# EAGLE design EPGinput (EAGLE 7.7.0)
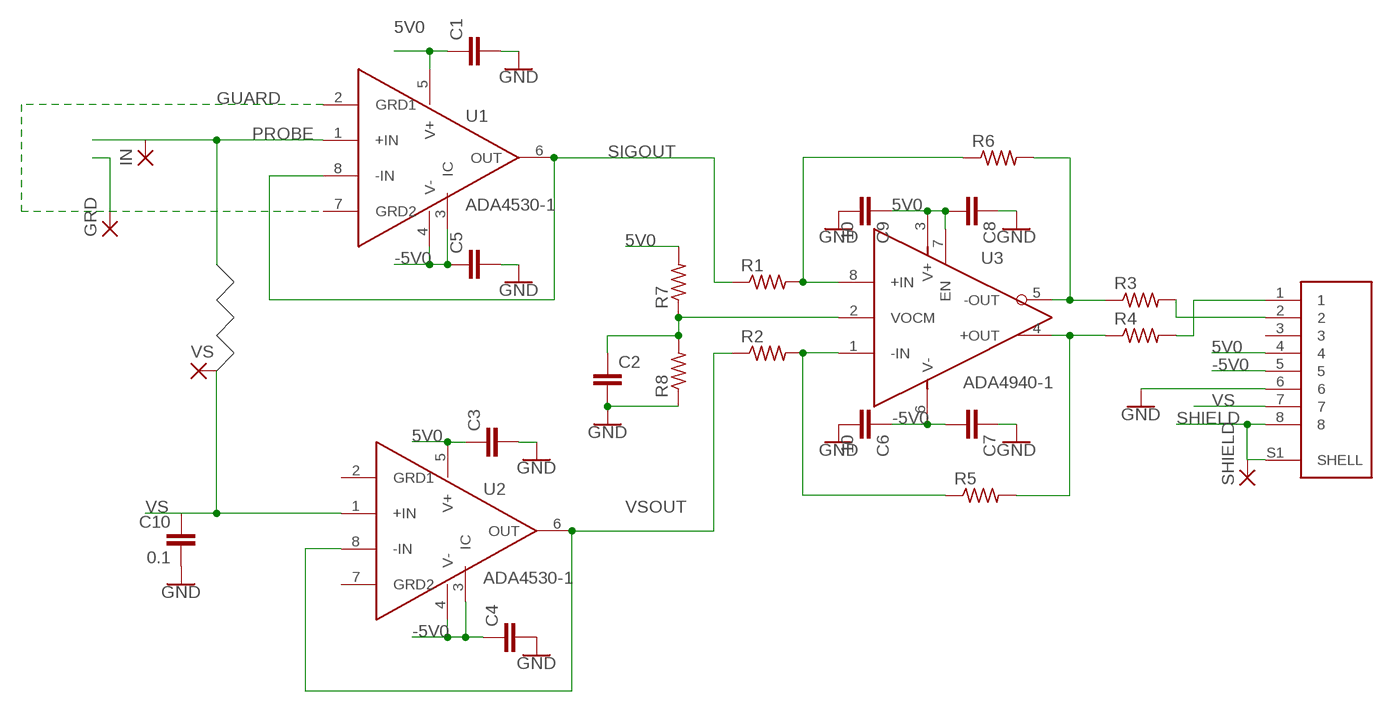
[diagram p0: schematic, sheet 1]

## Parts
C1  CAPS0603S  [0603S]
C2  CAPS0603S  [0603S]
C3  CAPS0603S  [0603S]
C4  CAPS0603S  [0603S]
C5  CAPS0603S  [0603S]
C6  10  CAPS1206S  [1206S]
C7  CAPS0603S  [0603S]
C8  CAPS0603S  [0603S]
C9  10  CAPS1206S  [1206S]
C10  0.1  CAPS0603S  [0603S]
GRD  2,15/1,0  [2,15/1,0]
IN  SMD2  [SMD1,27-2,54]
J1  54-00248  [TENSILITY_54-00248]
R1  RESISTOR_SM0805S  [0805S]
R2  RESISTOR_SM0805S  [0805S]
R3  RESISTOR_SM0805S  [0805S]
R4  RESISTOR_SM0805S  [0805S]
R5  RESISTOR_SM0805S  [0805S]
R6  RESISTOR_SM0805S  [0805S]
R7  RESISTOR_SM0805S  [0805S]
R8  RESISTOR_SM0805S  [0805S]
SHIELD  2,15/1,0  [2,15/1,0]
U1  ADA4530-1  [SOIC-8]
U2  ADA4530-1  [SOIC-8]
U3  ADA4940-1  [SOIC-8]
VS  2,15/1,0  [2,15/1,0]

## Nets
5V0: C1.1 C3.1 C8.2 C9.1 J1.4 R7.2 U1.5(V+) U2.5(V+) U3.3(V+) U3.7(EN)
-5V0: C4.1 C5.1 C6.1 C7.2 J1.5 U1.3(IC) U1.4(V-) U2.3(IC) U2.4(V-) U3.6(V-)
GND: C1.2 C2.2 C3.2 C4.2 C5.2 C6.2 C7.1 C8.1 C9.2 C10.2 J1.6 R8.1
GUARD: GRD.1(P) U1.2(GRD1) U1.7(GRD2)
N$1: C2.1 R7.1 R8.2 U3.2(VOCM)
N$6: R1.2 R6.1 U3.8(+IN)
N$7: R2.2 R5.1 U3.1(-IN)
N$9: J1.2 R3.2
N$10: J1.1 R4.2
N$19: R4.1 R5.2 U3.4(+OUT)
N$20: R3.1 R6.2 U3.5(-OUT)
PROBE: IN.1(P) U1.1(+IN)
SHIELD: J1.8 J1.S1(SHELL) SHIELD.1(P)
SIGOUT: R1.1 U1.6(OUT) U1.8(-IN)
VS: C10.1 J1.7 U2.1(+IN) VS.1(P)
VSOUT: R2.1 U2.6(OUT) U2.8(-IN)
Unconnected: J1.3 U2.2(GRD1) U2.7(GRD2)

## Library data of the parts
C1-C10 = STEVES_BU:CAPS
GRD SHIELD VS = wirepad:2,15/1,0: THROUGH-HOLE PAD
IN = wirepad:SMD2: SMD PAD
J1 = 54-00248:54-00248
R1-R8 = STEVES_BU:RESISTOR_SM
U1 U2 = EPG:ADA4530-1
U3 = EPG:ADA4940-1

## Board
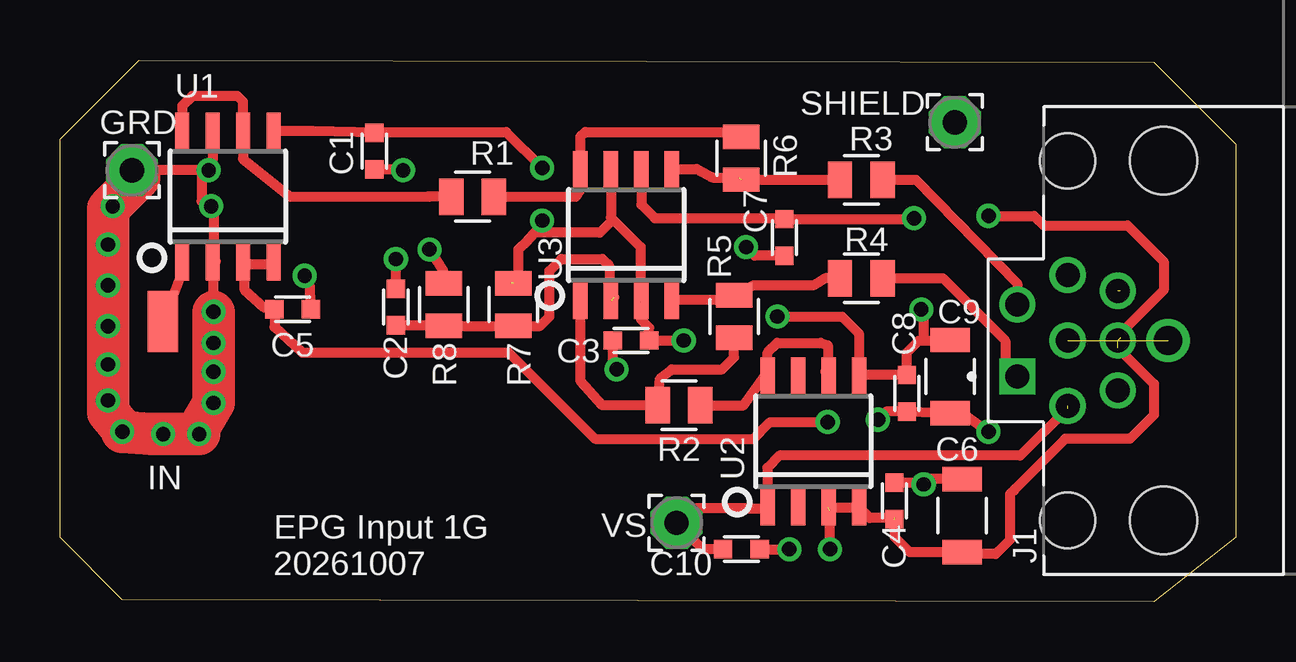
[diagram p1: board, top side]
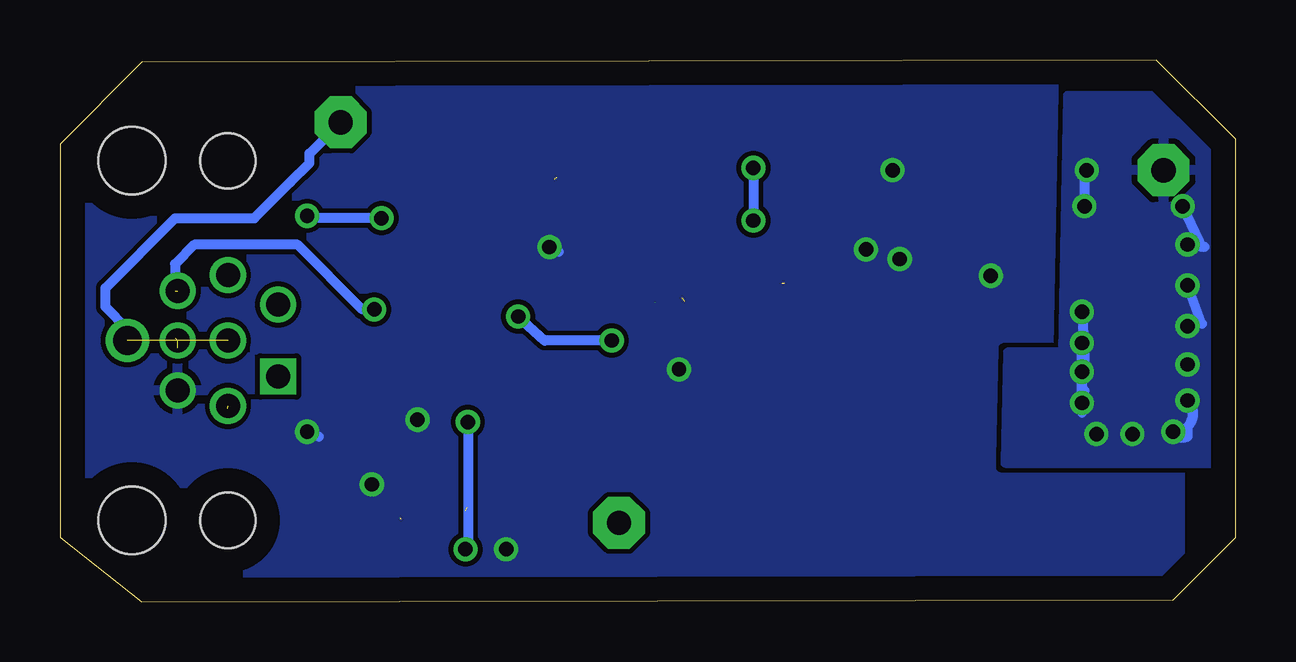
[diagram p2: board, bottom side, seen from below]

Size 49 x 22.6 mm. Coordinates in mm from the lower left corner, seen from the top.
Outline: 45.6,22.5 49,19.1 49,2.7 45.6,0 2.6,0.1 0,2.7 0,19.3 3.3,22.6 45.6,22.5
Copper layers (1*16): Top 0.035mm / dielectric 1.5mm / Bottom 0.035mm
Design rules "default *": minimum track width 10mil, minimum drill 15mil, track to track 8mil, track to pad 8mil, pad to pad 8mil, via to via 8mil, smd to smd 8mil, copper to edge 40mil, drill to drill 8mil, minimum pad ring 10mil, minimum via ring 8mil, stop-mask expansion 4mil, vias tented up to drill 0mil, thermal gap 10mil

### Footprints (pad centres in the part's own frame; a part is rotated, then mirrored left to right if it is on the bottom)
0603S = smd 0.762 x 0.762: 1 -0.762,0; 2 0.762,0
1206S = smd 1.016 x 1.651: 1 -1.524,0; 2 1.524,0
2,15/1,0 = drill 1.016 pad 2.159 octagon: 1 0,0
SMD1,27-2,54 = smd 1.27 x 2.54: 1 0,0
TENSILITY_54-00248 = drill 1 pad 1.4 square: 1 -1.5,2.1 | drill 1 pad 1.4: 2 1.5,2.1; 3 2.725,0; 4 2.075,-2.1; 5 0,-2.1; 6 -2.075,-2.1; 7 -2.725,0; 8 0,0 | drill 1.2 pad 1.7: S1 0,-4.191 | hole 2.3: -7.5,0; 7.5,0 | hole 2.8: -7.5,-4; 7.5,-4
0805S = smd 1.016 x 1.524: 1 -0.889,0; 2 0.889,0
SOIC-8 = smd 0.6 x 1.5: 1 -1.905,-2.75; 2 -0.635,-2.75; 3 0.635,-2.75; 4 1.905,-2.75; 5 1.905,2.75; 6 0.635,2.75; 7 -0.635,2.75; 8 -1.905,2.75

### Placement (x,y rotation side)
C1  13.1,18.8 270 top
C2  14,12.3 90 top
C3  23.8,10.9 180 top
C4  34.78,4.22 90 top
C5  9.7,12.2 0 top
C6  37.6,3.6 90 top
C7  30.2,15.2 90 top
C8  35.3,8.7 90 top
C9  37.1,9.4 270 top
C10  28.4,2.2 0 top
GRD  3,18 0 top
IN  4.3,11.7 0 top
J1  42,10.9 90 top
R1  17.2,16.9 0 top
R2  25.8,8.2 180 top
R3  33.4,17.6 0 top
R4  33.4,13.5 0 top
R5  28.1,11.9 90 top
R6  28.4,18.5 270 top
R7  18.9,12.4 90 top
R8  16,12.4 270 top
SHIELD  37.3,20 0 top
U1  7,16.9 0 top
U2  31.4,6.7 0 top
U3  23.6,15.3 0 top
U$1  POMONA2397  [POMONA2397]  23.7,10.9 0 top
VS  25.7,3.3 0 top

### Tracks (layer width: path | path; a pad name or v marks a point on that pad's centre or on a via)
5V0  (via drill 0.6)  (3 unrouted)
  Top 0.406: U3.7 22.96,16.04 | 22.96,16.04 24.2,14.8 24.2,12.5 24.3,12.4 | 22.96,16.04 22.96,15.87 22.5,15.4 19.8,15.4 19.5,15.1 | 19.5,15.1 19.1,14.7 19.1,13.6 18.8,13.3 | U3.3 24.2,12.52 24.2,11.8 24.56,11.44 C3.1 v26,10.9 | U1.5 10.55,19.65 13.2,19.6 | 13.2,19.6 13.14,19.6 C1.1 | 13.2,19.6 18.6,19.6 v20.1,18.1 | v20.1,15.9 20.1,15.6 20.2,15.5 19.9,15.5 19.5,15.1 | v29.9,11.9 32.6,11.9 33.3,11.2 U2.5 33.32,9.46 C8.2 35.3,10.4 35.8,10.9 36,10.9 | 36,10.9 37.08,10.9 C9.1 | 36,10.9 36,12.1 v35.9,12.2
  Bottom 0.406: v20.1,18.1 v20.1,15.9 | v26,10.9 28.8,10.9 v29.9,11.9 | 44.2,12.98 44.2,14.1 43.4,14.9 39.1,14.9 36.4,12.2 v35.9,12.2
-5V0  (via drill 0.6)  (4 unrouted)
  Top 0.406: U2.3 U2.4 33.76,3.5 34.6,3.5 34.65,3.45 C4.1 | 7.7,14.09 7.7,13 8.54,12.26 C5.1 8.94,11.46 10.1,10.4 18.7,10.4 22.3,6.8 28.9,6.8 29.6,7.5 v32,7.5 | 7.7,14.09 U1.3 | 7.7,14.09 8.84,14.09 U1.4 | 44.1,10.6 45.6,9.1 45.6,7.8 44.6,6.8 41.9,6.8 39.8,4.7 39.6,4.5 39.6,2.6 39,2 37.68,2 C6.1 35.42,2.08 34.8,2.7 34.8,3.5 34.9,3.6 | v32.1,2.2 32.1,3.8 | U3.6 24.23,16.57 24.8,16 30.1,16 | 30.1,16 30.2,16 | 30.1,16 30.06,15.96 C7.2 35.56,15.96 v35.6,16 | v38.7,16.1 40.6,16.1 41,15.7 44.5,15.7 46,14.2 46,13 44.2,11.2 44.2,11
  Bottom 0.406: v32,7.5 32,2.3 v32.1,2.2 | v35.6,16 38.7,16 v38.7,16.1
GND  (via drill 0.6)
  Top 0.406: R8.1 15.99,13.79 v15.4,14.7 | C5.2 10.4,13.4 v10.2,13.6 | C3.2 23.04,9.86 v23.2,9.7 | C7.1 28.96,14.44 v28.6,14.8 | v34.1,7.6 34.44,7.94 C8.1 C9.2 37.62,7.88 v38.7,7.1 | C4.2 36.02,4.98 36.1,4.9 v36,4.9 36.22,5.12 C6.2 | C1.2 14.26,18.04 v14.3,18 | C2.2 v14,14.3 | C10.2 v30.4,2.2
  Bottom 0.406: v23.2,9.7 23.2,9.6 | v28.6,14.8 28.4,14.8 28.2,14.6 | v34.1,7.6 33.9,7.6 33.8,7.5 | v36,4.9 36,4.7 | v14.3,18 14.1,17.8 | v14,14.3 13.8,14.3 13.7,14.2 | v38.7,7.1 38.2,6.9 | v30.4,2.2 30.4,2
  pour Bottom (rank 2): 2.3,22.8 52.6,22.8 52.6,-1.7 2.3,-1.7
GUARD  (via drill 0.6)
  Top 0.406: U1.7 6.36,18.46 5.9,18 | 5.9,18 5.8,18 | 5.8,18 3.2,18 GRD.1 | 5.9,18 5.9,16.7 6.1,16.5 | 6.1,16.5 6.4,16.2 6.4,14.4 6.4,14.19 U1.2 | v6.4,10.8 v6.4,12.1 6.4,10 v6.4,10.8 | v6.4,10.8 6.4,14.1 6.5,14.2 | v6.4,10.8 arc90 6.3,8.4 6.3,8.1 arc-90 6.4,8 v6.4,8.3 arc-90 v5.8,7 | v4.3,7 arc-90 4,6.4 3.7,6.4 arc90 3.8,7 v2.6,7.1 | v2,8.4 2.1,8.2 arc-90 2,8.3 v2,9.9 | v2,9.9 2,10.1 v2,9.9 | v2,9.9 v2,11.5 | v2,13.2 arc-90 2,13.3 2,13.6 v2,14.9 | v2.2,16.5 arc90 2.1,16.4 | 5.8,18 v6.2,18 | v6.3,16.5 6.1,16.5
  Top 1.778: 3.1,17.8 3.3,17.7 2,16.4 v2,14.9 2,13.6 v2,11.5 2,10.1 v2,9.9 2,7.9 2.6,7.2 v2.6,7.1 3.8,7 v5.8,7 5.7,7.1 v6.4,8.3 v6.4,10.8 6.4,9.7 6.4,10 v6.4,12.1
  Bottom 0.406: v6.4,12.1 6.3,10.5 6.3,9.3 6.4,9.2 6.4,8.7 | 6.4,8.7 v6.4,10.8 | v6.4,10.8 6.4,8.1 6.3,8.1 6.3,8.8 arc-90 6.4,8.7 | 6.4,8.7 v6.4,10.8 | v6.4,10.8 6.4,7.9 | v2.6,7.1 arc-90 2,6.9 2,7.3 arc-90 v2,8.4 | 1.4,11.6 v2,13.2 | v2,14.9 1.3,14.8 arc90 1.5,15 v2.2,16.5 | v6.2,18 6.3,18 v6.3,16.5
  other vias: 6.4,9.6
  pour Bottom (isolate 1): 0.4,19.6 2,21.1 7,21.1 7.2,10.4 9.5,10.4 9.6,5.8 0.5,5.8
N$1  (1 unrouted)
  Top 0.406: 23.1,12.7 22.9,12.9 22.9,14 22.6,14.3 20.9,14.3 20.4,13.8 20.4,11.9 20.01,11.51 R7.1 R8.2 15.97,11.54 C2.1
N$6
  Top 0.406: R1.2 21.5,16.9 21.7,17.2 U3.8 21.7,19.39 21.9,19.6 27.79,19.6 R6.1
N$7
  Top 0.406: U3.1 21.7,9.2 22.6,8.2 R2.2 25.01,9.31 25.5,9.7 27.6,9.7 28.1,10.2 R5.1 | R5.1 28.2,11.1 28.1,10.8 R5.1 | R5.1 28.1,11.21 R5.1
N$9
  Top 0.406: R3.2 35.68,17.6 39.9,13.28 J1.2
N$10
  Top 0.406: R4.2 35.17,13.5 36.8,13.5 39.4,10.9 39.4,9.9 J1.1
N$19
  Top 0.406: U3.4 25.55,12.6 26.2,12.6 26.3,12.6 27.6,12.6 27.69,12.89 R5.2 28.91,13.2 31.4,13.2 31.9,13.5 R4.1
N$20  (1 unrouted)
  Top 0.406: U3.5 26.55,18.05 27.2,17.7 28.3,17.7 28.5,17.7 | R6.2 32.2,17.61 R3.1
PROBE
  Top 0.406: U1.1 5.05,13.65 IN.1
SHIELD  (1 unrouted)
  Bottom 0.406: J1.S1 46.19,11.39 47.1,12.3 47.1,13.1 44.2,16 40.9,16 39.4,17.5 38.6,18.3 38.6,18.7 SHIELD.1
SIGOUT
  Top 0.406: 15.3,16.9 9.6,16.9 7.63,18.46 U1.6 7.63,20.87 7.4,21.1 5.5,21.1 5.1,20.7 U1.8 | 15.3,16.9 15.4,16.9 | R1.1 15.3,16.9
VS  (1 unrouted)
  Top 0.406: 42,8.07 40.03,6.1 29.99,6.1 29.49,5.59 29.49,3.96 U2.1 29.45,3.9 28.6,3.9 26.3,3.9 VS.1 25.8,3.2 26.8,2.2 C10.1
VSOUT
  Top 0.406: U2.8 29.5,9.6 | 29.5,9.6 29.5,10.39 29.9,10.8 31.7,10.8 32,10.7 32,9.6 | 32,9.6 32,9.48 U2.6 32.03,9.46 31.9,9.6 32,9.6 | R2.1 28.5,8.2 29.5,9.6

### Text on the board
tPlace: EPG Input 1G / 20261007